# EAGLE design lato1 (EAGLE 9.3.1)
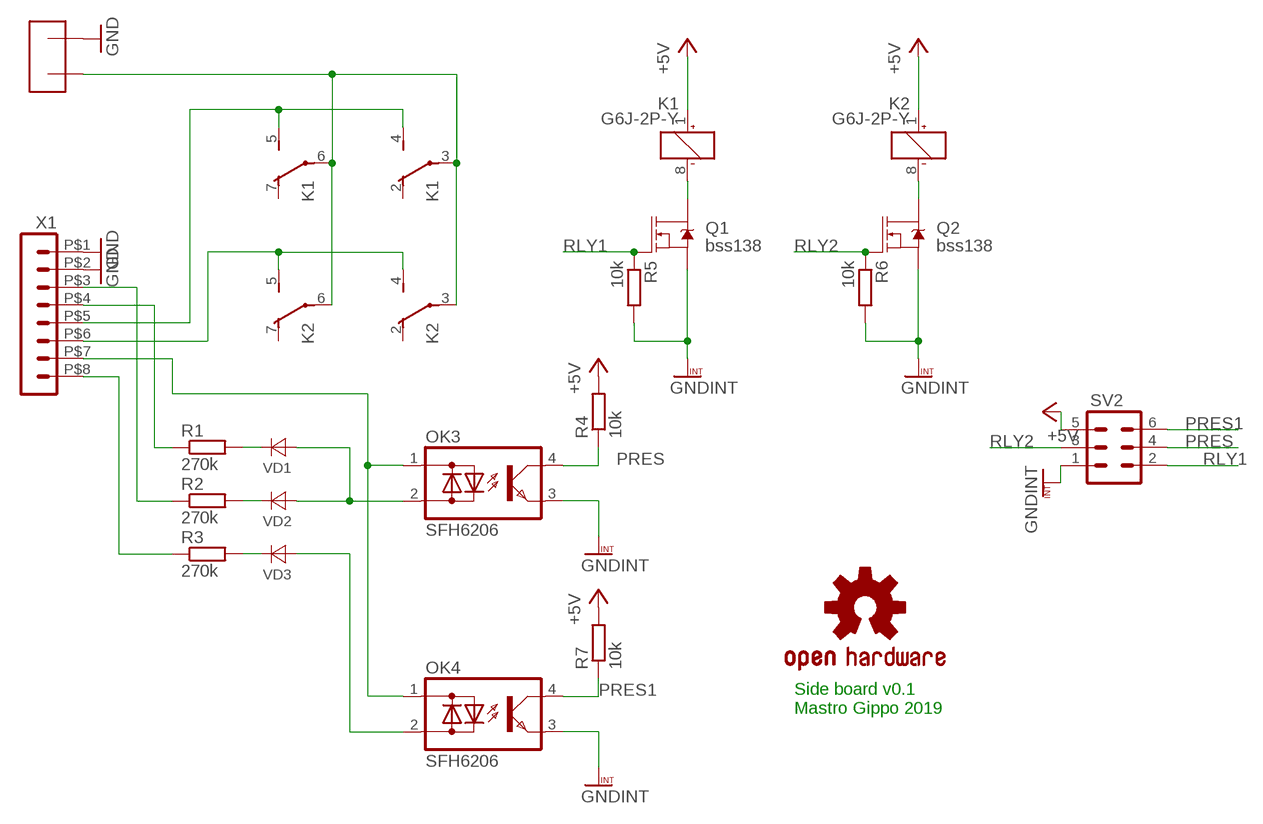
[diagram p0: schematic, sheet 1]

## Parts
K1  G6J-2P-Y  [G6J-2P-Y]
K2  G6J-2P-Y  [G6J-2P-Y]
OK3  SFH6206  [DIL4-SMD]
OK4  SFH6206  [DIL4-SMD]
Q1  bss138  MOSFET-NCH-BSS138  [SOT23-3]
Q2  bss138  MOSFET-NCH-BSS138  [SOT23-3]
R1  270k  R-EU_R1210  [R1210]
R2  270k  R-EU_R1210  [R1210]
R3  270k  R-EU_R1210  [R1210]
R4  10k  R-EU_R0805  [R0805]
R5  10k  R-EU_R0805  [R0805]
R6  10k  R-EU_R0805  [R0805]
R7  10k  R-EU_R0805  [R0805]
SV2  MA03-2  [MA03-2]
U$1  ISOLATED_2P  [STRIP_NOMIDDLE]
U$2  OSHW-LOGOS  [OSHW-LOGO-S]
VD1  DIODE-STANDARD-SOD323  [SOD323]
VD2  DIODE-STANDARD-SOD323  [SOD323]
VD3  DIODE-STANDARD-SOD323  [SOD323]
X1  HEADER_POS8_43045-0812  [43045-0812]

## Nets
+5V: K1.1(1:+) K2.1(1:+) R4.2 R7.2 SV2.5
GND: U$1.P$1 X1.P$1 X1.P$2
GNDINT: OK3.3(E) OK4.3(E) Q1.2(S) Q2.2(S) R5.2 R6.2 SV2.1
N$1: K1.3(2:P) K1.6(3:P) K2.3(2:P) K2.6(3:P) U$1.P$2
N$2: K1.4(2:S) K1.5(3:S) X1.P$5
N$3: K2.4(2:S) K2.5(3:S) X1.P$6
N$4: R1.1 X1.P$4
N$5: R2.1 X1.P$3
N$6: R3.1 X1.P$8
N$7: OK3.1(AC1) OK4.1(AC1) X1.P$7
N$8: R1.2 VD1.C
N$9: R3.2 VD3.C
N$11: OK4.2(AC2) VD3.A
N$12: K1.8(1:-) Q1.3(D)
N$13: R2.2 VD2.C
N$14: K2.8(1:-) Q2.3(D)
N$15: OK3.2(AC2) VD1.A VD2.A
PRES: OK3.4(C) R4.1 SV2.4
PRES1: OK4.4(C) R7.1 SV2.6
RLY1: Q1.1(G) R5.1 SV2.2
RLY2: Q2.1(G) R6.1 SV2.3
Unconnected: K1.2(2:O) K1.7(3:O) K2.2(2:O) K2.7(3:O)

## Notes on the sheet
- Side board v0.1
  Mastro Gippo 2019

## Library data of the parts
K1 K2 = relay:G6J*-2?-Y: Surface-Mounting Signal Relay - G6J-Y 5.7 x 10.6 x 9 mm Source: http://www.omroncomponents.eu/ .. K125-E2-02-X.pdf; MF: OMRON COMPONENTS USA; MPN: G6J-2P-Y-DC12; OC_FARNELL: unknown; OC_NEWARK: 70J9830
OK3 OK4 = optocoupler:SFH620: Optocoupler, Phototransistor Output, AC Input Source: http://www.vishay.com/docs/83675/sfh620.pdf; MF: VISHAY/TELEFUNKEN; MPN: SFH6206-3; OC_FARNELL: 1469585; OC_NEWARK: 58K2214
Q1 Q2 = SparkFun-DiscreteSemi:MOSFET-NCH: N-channel MOSFETs Voltage controlled devices that allow control of high current outputs. SparkFun Products: SparkFun OpenScale <https://www.sparkfun.com/products/13261> SparkFun Digital Sandbox <https://www.sparkfun.com/products/12651> SparkFun Monster Moto Shield <https://www.sparkfun.com/products/10182> SparkFun MOSFET Power Controller <https://www.sparkfun.com/products/11214>; PROD_ID: TRANS-00830; VALUE: 220mA/50V/3.5Ω
R1-R7 = rcl:R-EU_: RESISTOR, European symbol; SPICEPREFIX: R
SV2 = con-lstb:MA03-2: PIN HEADER; OC_FARNELL: unknown; OC_NEWARK: unknown
U$1 = mastrogippo:ISOLATED_2P
U$2 = mastrogippo:OSHW-LOGO: Open Source Hardware Logo This logo indicates the piece of hardware it is found on incorporates a OSHW license and/or adheres to the definition of open source hardware found here: http://freedomdefined.org/OSHW
VD1-VD3 = diode:DIODE-STANDARD-
X1 = con-molex-micro-fit-3_0:HEADER_POS8_?: Molex - Micro-Fit 3.0 Series connector, 3.00mm (0.118") pitch header, 8 positions.

## Board
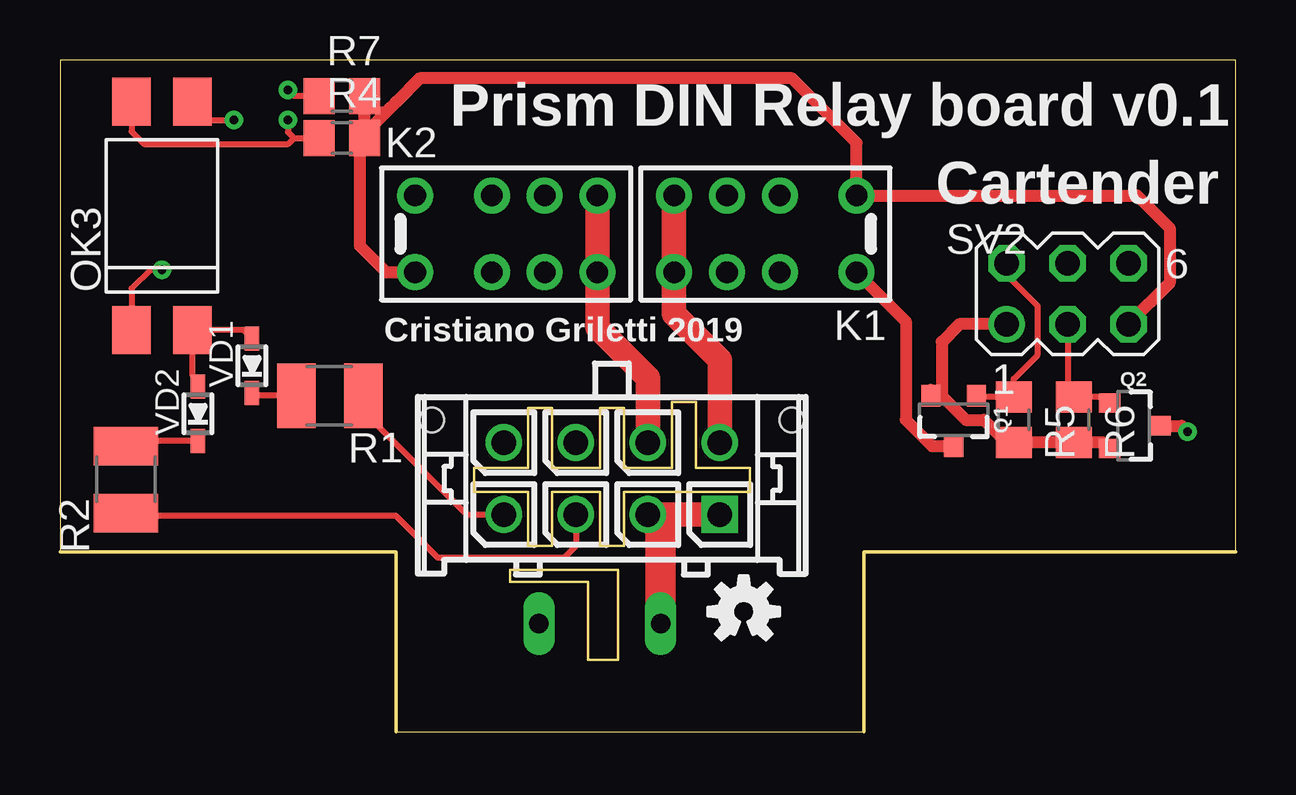
[diagram p1: board, top side]
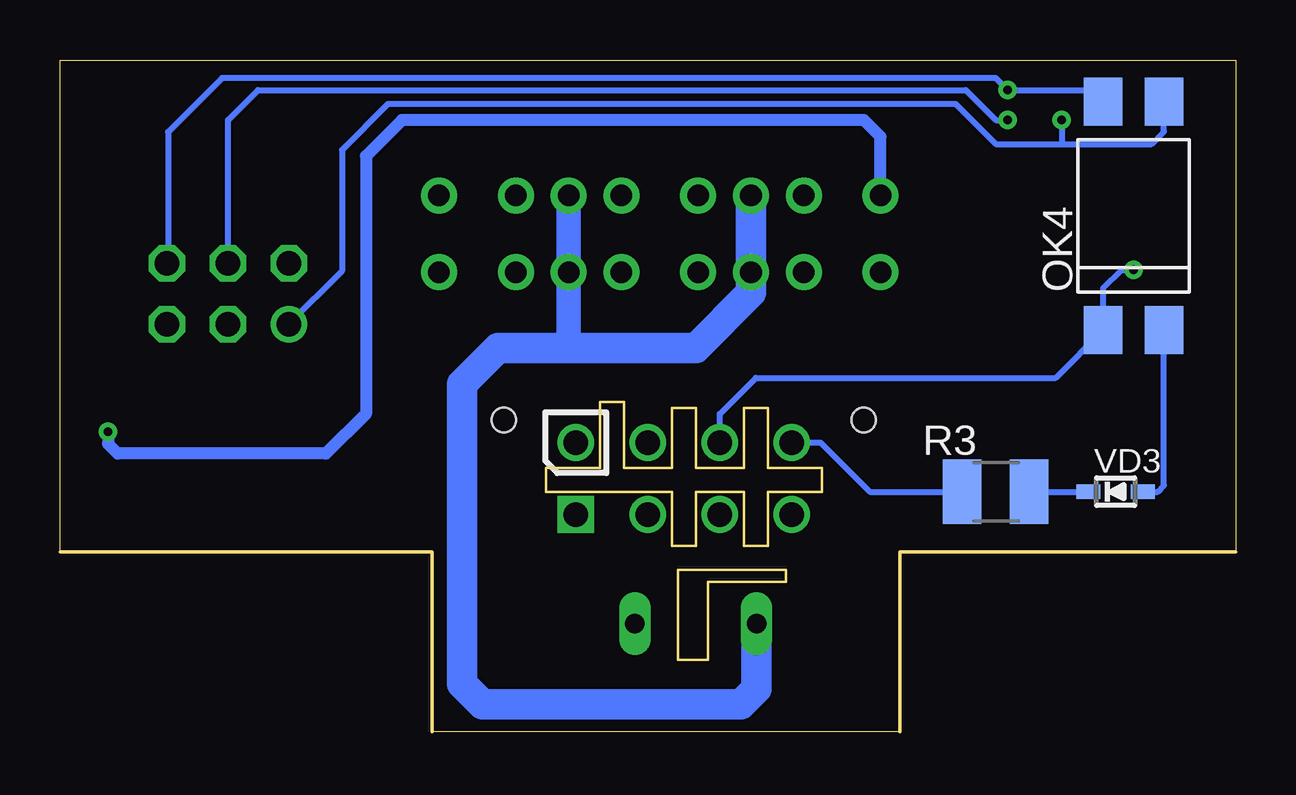
[diagram p2: board, bottom side, seen from below]

Size 49 x 28 mm. Coordinates in mm from the lower left corner, seen from the top.
Outline: 14,0 33.5,0 33.5,7.5 49,7.5 49,28 0,28 0,7.5 14,7.5 14,0
Copper layers (1*16): Top 0.035mm / dielectric 1.5mm / Bottom 0.035mm
Design rules "default *": minimum track width 6mil, minimum drill 0.35mm, track to track 8mil, track to pad 6mil, pad to pad 6mil, via to via 6mil, smd to smd 6mil, copper to edge 20mil, drill to drill 6mil, minimum pad ring 10mil, minimum via ring 8mil, stop-mask expansion 4mil, vias tented up to drill 0mil, thermal gap 10mil
Milling: 30 lines

### Footprints (pad centres in the part's own frame; a part is rotated, then mirrored left to right if it is on the bottom)
G6J-2P-Y = drill 0.9 pad 1.5: 1 -3.2,-1.6; 2 0,-1.6; 3 2.2,-1.6; 4 4.4,-1.6; 5 4.4,1.6; 6 2.2,1.6; 7 0,1.6; 8 -3.2,1.6
DIL4-SMD = smd 1.6 x 2: 1 -1.27,-4.77; 2 1.27,-4.77; 3 1.27,4.77; 4 -1.27,4.77
SOT23-3 = smd 0.8 x 0.9: 1 -0.95,-1; 2 0.95,-1; 3 0,1.1
R1210 = smd 1.6 x 2.7: 1 -1.4,0; 2 1.4,0
R0805 = smd 1.3 x 1.5: 1 -0.95,0; 2 0.95,0
MA03-2 = drill 1.016: 1 -2.54,-1.27 | drill 1.016 octagon: 2 -2.54,1.27; 3 0,-1.27; 4 0,1.27; 5 2.54,-1.27; 6 2.54,1.27
STRIP_NOMIDDLE = drill 0.8 long: P$1 -2.54,0; P$2 2.54,0
SOD323 = smd 1 x 0.6: A 1.143,0; C -1.143,0
43045-0812 = drill 1.02 square: P$1 4.5,0 | drill 1.02: P$2 1.5,0; P$3 -1.5,0; P$4 -4.5,0; P$5 4.5,3; P$6 1.5,3; P$7 -1.5,3; P$8 -4.5,3 | hole 1.02: 7.5,3.94; -7.5,3.94

### Placement (x,y rotation side)
K1  30,20.75 180 top
K2  18,20.75 0 top
OK3  4.25,21.5 0 top
OK4  4.25,21.5 0 bottom
Q1  37.25,13 180 top
Q2  44.75,12.75 270 top
R1  11.25,14 180 top
R2  2.75,10.5 90 top
R3  10,10 0 bottom
R4  11.75,24.75 0 top
R5  39.75,13 270 top
R6  42.25,13 270 top
R7  11.75,26.5 0 top
SV2  42,18.25 0 top
U$1  22.5,4.5 180 top
U$2  28.5,5 0 top
VD1  8,15.25 90 top
VD2  5.75,13.25 90 top
VD3  5,10 0 bottom
X1  23,9.05 0 top

### Tracks (layer width: path | path; a pad name or v marks a point on that pad's centre or on a via)
+5V
  Top 0.152: R7.2 12.72,26.48 13.2,26 13.75,26
  Top 0.508: 33.3,22.25 K1.1 | K1.1 33.2,24.55 30.51,27.24 14.99,27.24 14,26.25 13.75,26 12.5,24.75 12.5,20.25 13.6,19.15 K2.1 | R4.2 12.7,26.45 12.72,26.48 | K1.1 44.9,22.35 46.25,21 46.25,18.69 SV2.5
GND
  Top 1.016: X1.P$2 X1.P$1
  Top 1.27: U$1.P$1 25.04,8.51 X1.P$2
GNDINT  (via drill 0.35)
  Top 0.254: OK3.3 6.29,25.5 v7.25,25.5
  Top 0.508: 36.3,14.25 Q1.2 36.75,14 | 36.75,14 37.75,13 38.5,13 39.45,12.05 R5.2 R6.2 43.5,12.05 Q2.2 | SV2.1 37.48,16.98 36.75,16.25 36.75,14
  Bottom 0.254: SV2.1 37.25,19.19 37.25,24.25 35.34,26.16 11.66,26.16 10,24.5 7.25,24.5 | 7.25,24.5 3.5,24.5 2.98,25.02 OK4.3 | v7.25,25.5 7.25,24.5
N$1
  Bottom 1.016: K1.3 K1.6 27.8,16
  Bottom 1.27: K2.6 K2.3 20.2,18.3 22.5,16 27.8,16 30.75,16 32.25,14.5 32.25,2 31.39,1.14 20.61,1.14 19.96,1.79 U$1.P$2
N$2
  Top 1.016: K1.4 K1.5 25.6,17.4 27.5,15.5 X1.P$5
N$3
  Top 1.016: K2.5 K2.4 22.4,16.85 24.5,14.75 X1.P$6
N$4
  Top 0.254: R1.1 12.65,13.35 16.95,9.05 X1.P$4
N$5
  Top 0.254: X1.P$3 21.5,7.75 21,7.25 15.75,7.25 14,9 2.85,9 R2.1
N$6
  Bottom 0.254: X1.P$8 17.3,12.05 15.25,10 R3.1
N$7  (via drill 0.35)
  Top 0.254: v4.25,19.25 3.75,19.25 2.98,18.48 OK3.1
  Bottom 0.254: X1.P$7 21.5,13.25 20,14.75 7.5,14.75 OK4.1 5.52,18.48 4.75,19.25 v4.25,19.25
N$8
  Top 0.254: 8.14,14 8.1,14.01 | VD1.C 8.1,14.01 | R1.2 8.1,14.01
N$9
  Bottom 0.254: R3.2 VD3.C
N$11
  Bottom 0.254: VD3.A 3.25,10 2.98,10.27 OK4.2
N$12
  Top 0.508: K1.8 35.25,17.1 35.25,13 36.35,11.9 Q1.3
N$13
  Top 0.254: VD2.C 2.96,12.11 R2.2
N$14  (via drill 0.35)
  Top 0.508: v47,12.5 46.75,12.75 Q2.3
  Bottom 0.508: K2.8 14.8,24.8 15.5,25.5 34.75,25.5 36.25,24 36.25,13.25 37.91,11.59 46.59,11.59 47,12 v47,12.5
N$15
  Top 0.254: VD2.A 5.79,14.58 5.52,14.85 OK3.2 7.66,16.73 VD1.A
PRES  (via drill 0.35)
  Top 0.254: v9.5,25.5 9.5,25 9.75,24.75 | 9.75,24.75 R4.1 | OK3.4 2.98,25.02 3.5,24.5 9.5,24.5 9.75,24.75
  Bottom 0.254: SV2.4 42,25.5 40.75,26.75 11.25,26.75 10,25.5 v9.5,25.5
PRES1  (via drill 0.35)
  Top 0.152: 10.78,26.52 R7.1
  Top 0.254: R7.1 9.75,26.5 v9.5,26.75
  Bottom 0.254: SV2.6 44.5,19.56 44.5,25 42.25,27.25 10,27.25 v9.5,26.75 5.5,26.75 5.5,26.29 OK4.4
RLY1
  Top 0.254: 39.66,14.04 R5.1 | R5.1 38.25,13.95 Q1.1 | SV2.2 39.46,19.04 40.75,17.75 40.75,15.7 39.75,14.7 R5.1
RLY2
  Top 0.254: 42.2,14 R6.1 | Q2.1 43.5,13.95 R6.1 | SV2.3 42,14.2 R6.1

### Text on the board
tNames: Prism DIN Relay board v0.1 | Cartender | Cristiano Griletti 2019